# Altium schematic sheet 1_P1.schdoc
size 553 x 393 mm; Symbol: Sheet-Symbol_A4; Device: Sheet-Symbol_A4; @Page Name: P1; @Create Date: 2024-02-03; @Page Count: 1; @Page No: 1; @Project Name: 扫地机器人; @Schematic Name: Schematic1; @Update Date: 2025-04-30; Company: 嘉立创EDA; Page Size: A4; Version: V1.0
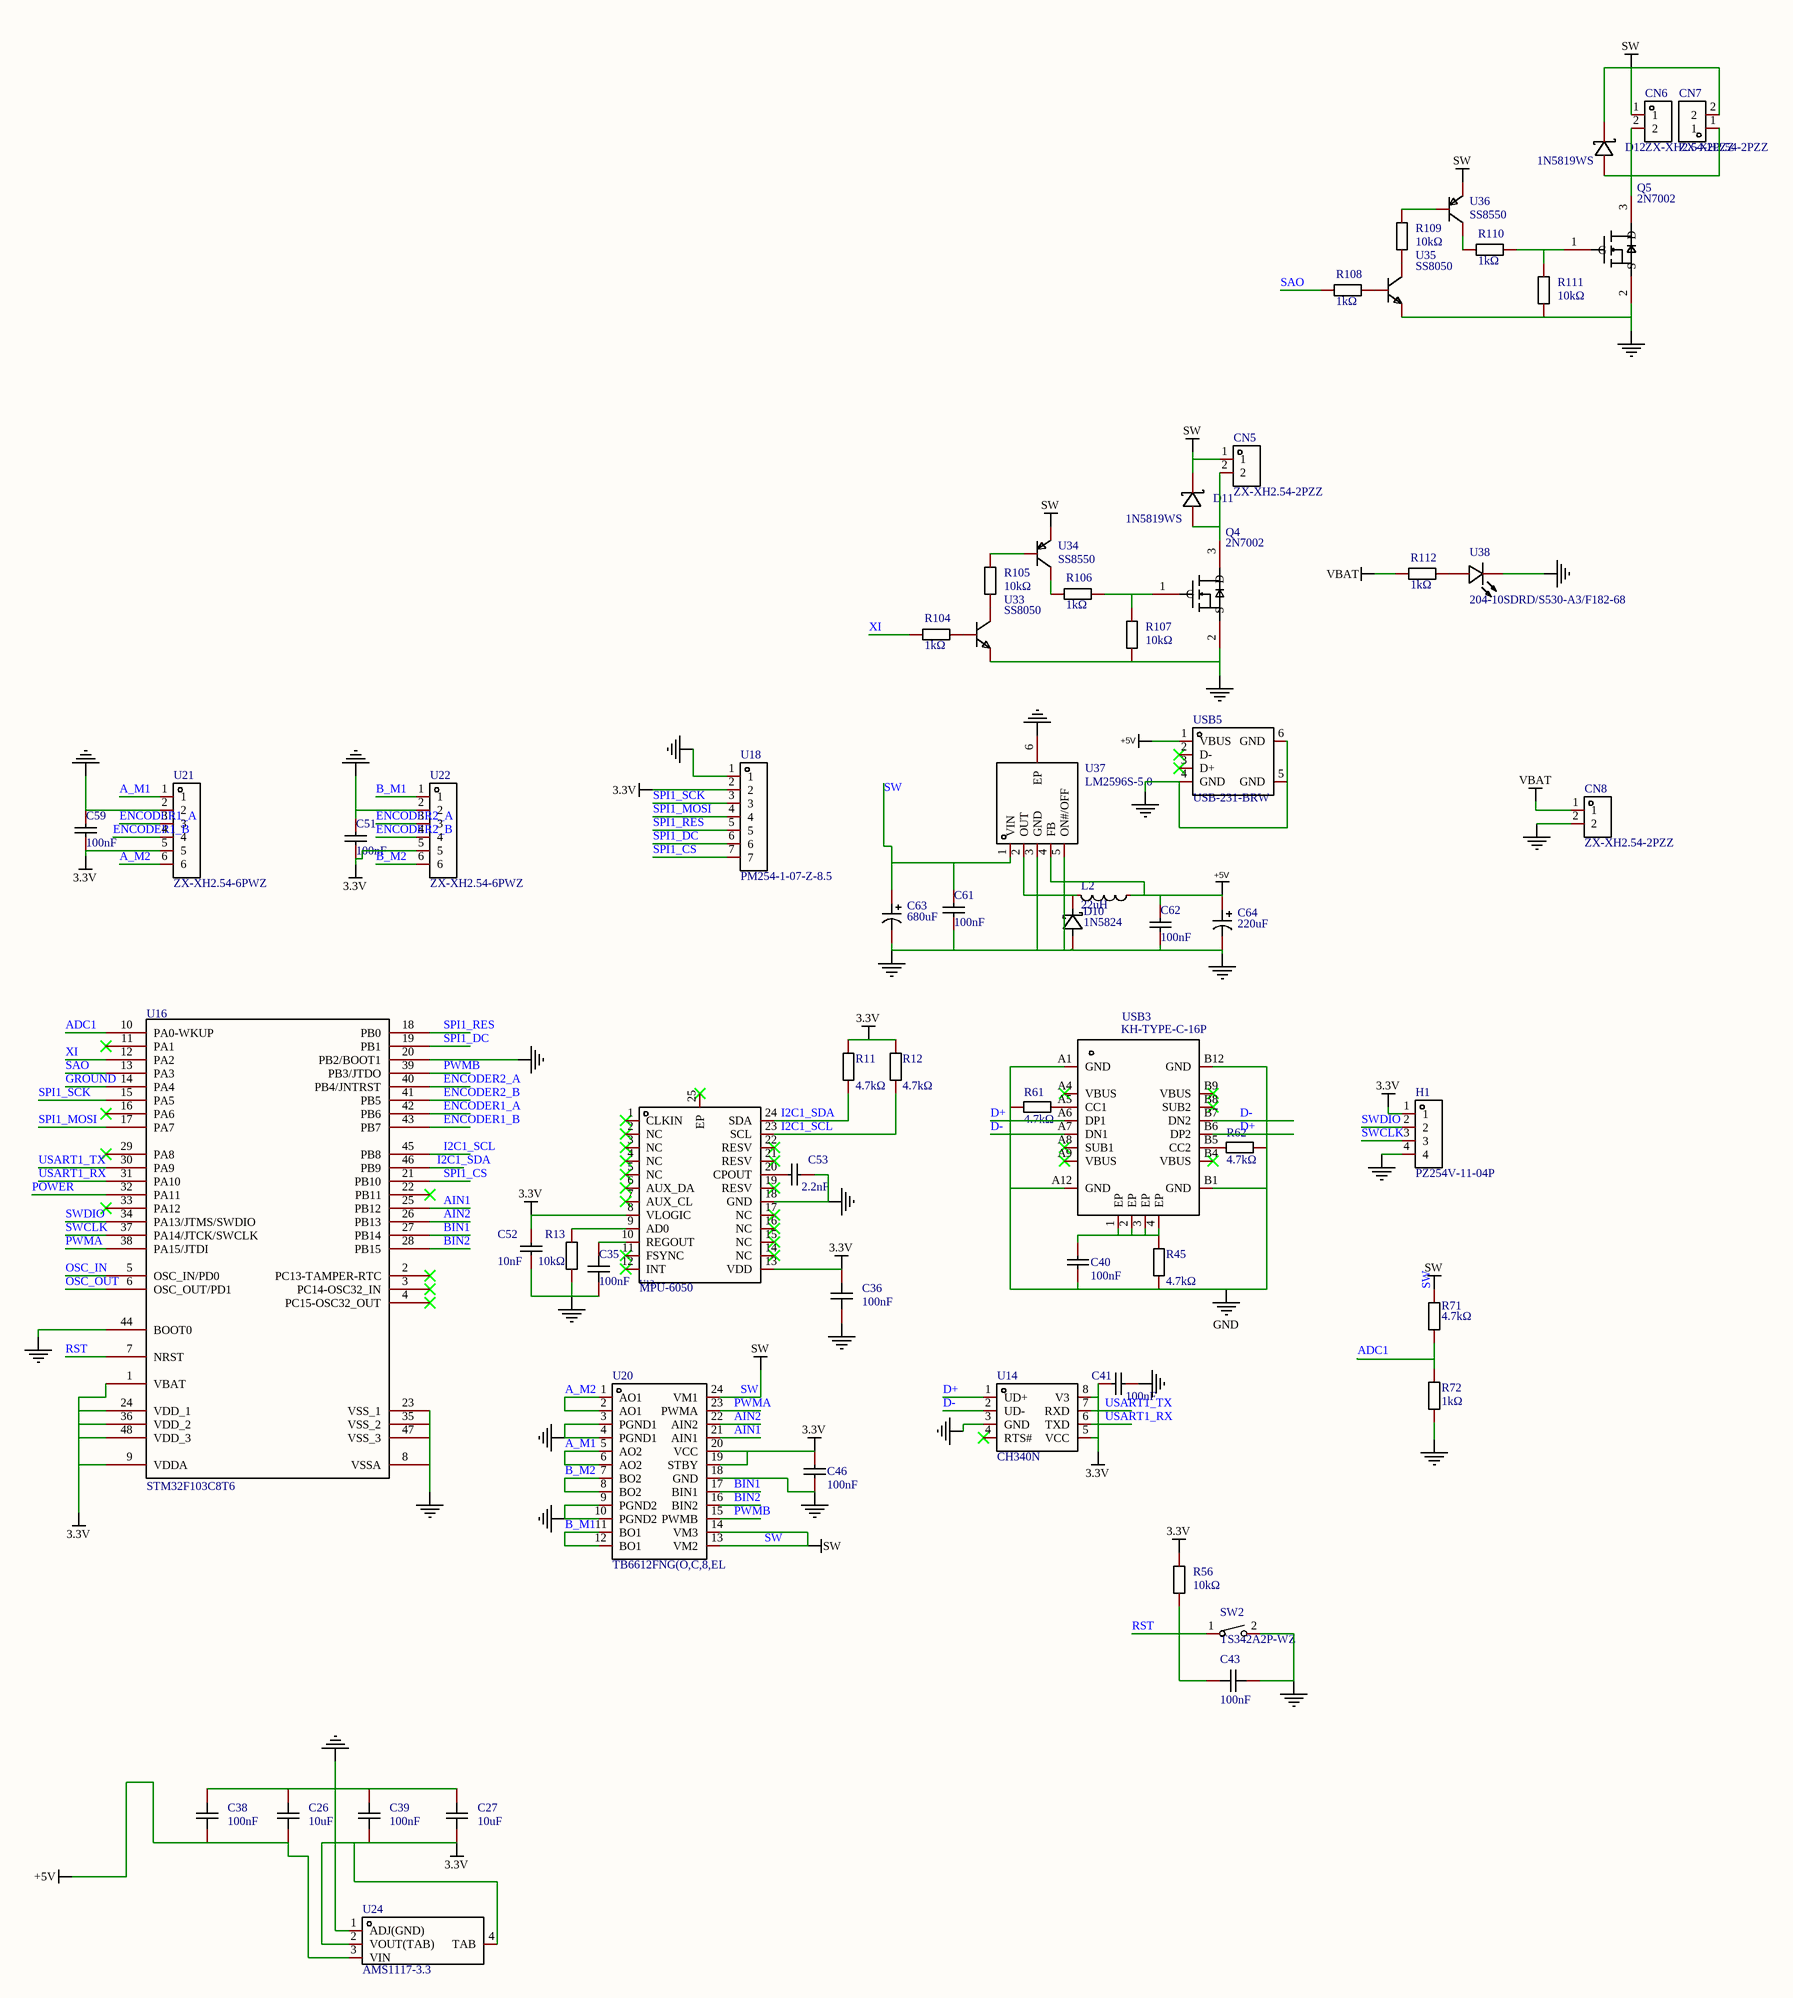
[diagram p0: 1_P1.schdoc]

## Parts
C26  10uF  [C0603]
C27  10uF  [C0603]
C35  100nF  [C0603]
C36  100nF  [C0603]
C38  100nF  [C0603]
C39  100nF  [C0603]
C40  100nF  [C0603]
C41  100nF  [C0603]
C43  100nF  [C0603]
C46  100nF  [C0603]
C51  100nF  [C0603]
C52  10nF  [C0603]
C53  2.2nF  [C0603]
C59  100nF  [C0603]
C61  100nF  [C0603]
C62  100nF  [C0603]
C63  680uF  [CAP-TH_BD10.0-P5.00-D0.6-FD]
C64  220uF  [CAP-TH_BD8.0-P3.50-D0.6-FD]
CN5  ZX-XH2.54-2PZZ  [CONN-TH_2P-P2.50_HX25003-2A]
CN6  ZX-XH2.54-2PZZ  [CONN-TH_2P-P2.50_HX25003-2A]
CN7  ZX-XH2.54-2PZZ  [CONN-TH_2P-P2.50_HX25003-2A]
CN8  ZX-XH2.54-2PZZ  [CONN-TH_2P-P2.50_HX25003-2A]
D10  1N5824  [DO-27_BD5.3-L8.4-P12.40-D1.3-RD]
D11  1N5819WS  [SOD-323_L1.8-W1.3-LS2.5-RD]
D12  1N5819WS  [SOD-323_L1.8-W1.3-LS2.5-RD]
H1  PZ254V-11-04P  [HDR-TH_4P-P2.54-V-M]
L2  22uH  [IND-SMD_L7.1-W6.6]
Q4  2N7002  [SOT-23-3_L2.9-W1.3-P1.90-LS2.4-BR]
Q5  2N7002  [SOT-23-3_L2.9-W1.3-P1.90-LS2.4-BR]
R11  4.7kΩ  [R0603]
R12  4.7kΩ  [R0603]
R13  10kΩ  [R0805]
R45  4.7kΩ  [R0603]
R56  10kΩ  [R0805]
R61  4.7kΩ  [R0603]
R62  4.7kΩ  [R0603]
R71  4.7kΩ  [R0603]
R72  1kΩ  [R0603]
R104  1kΩ  [R0603]
R105  10kΩ  [R0805]
R106  1kΩ  [R0603]
R107  10kΩ  [R0805]
R108  1kΩ  [R0603]
R109  10kΩ  [R0805]
R110  1kΩ  [R0603]
R111  10kΩ  [R0805]
R112  1kΩ  [R0603]
SW2  TS342A2P-WZ  [SW-SMD_L4.0-W2.9-LS5.0]
U12  MPU-6050  [QFN-24_L4.0-W4.0-P0.50-BL-EP2.7]
U14  CH340N  [SOP-8_L4.9-W3.9-P1.27-LS6.0-BL]
U16  STM32F103C8T6  [LQFP-48_L7.0-W7.0-P0.50-LS9.0-BL]
U18  PM254-1-07-Z-8.5  [HDR-TH_7P-P2.54-V-F]
U20  TB6612FNG(O,C,8,EL  [SSOP-24_L8.4-W5.8-P0.65-LS7.8-BL]
U21  ZX-XH2.54-6PWZ  [CONN-TH_6P-P2.50_ZX-XH2.54-6PWZ]
U22  ZX-XH2.54-6PWZ  [CONN-TH_6P-P2.50_ZX-XH2.54-6PWZ]
U24  AMS1117-3.3  [SOT-223_L6.7-W3.5-P2.30-BR]
U33  SS8050  [SOT-23-3_L2.9-W1.3-P1.90-LS2.4-BR]
U34  SS8550  [SOT-23-3_L2.9-W1.3-P1.90-LS2.4-BR]
U35  SS8050  [SOT-23-3_L2.9-W1.3-P1.90-LS2.4-BR]
U36  SS8550  [SOT-23-3_L2.9-W1.3-P1.90-LS2.4-BR]
U37  LM2596S-5.0  [TO-263-5_L10.2-W8.9-P1.70-BR]
U38  204-10SDRD/S530-A3/F182-68  [LED-TH_BD4.0-P2.50-RD]
USB3  KH-TYPE-C-16P  [USB-C-SMD_KH-TYPE-C-16P]
USB5  USB-231-BRW  [USB-A-TH_USB-231-ARY]

## Nets
3.3V: C27.1 C36.2 C39.1 C41.1 C46.1 C51.2 C52.1 C59.2 H1.1 R11.2 R12.2 R56.2 U12.8(VLOGIC) U12.13(VDD) U14.5(VCC) U14.8(V3) U16.1(VBAT) U16.9(VDDA) U16.24(VDD_1) U16.36(VDD_2) U16.48(VDD_3) U18.2 U20.19(STBY) U20.20(VCC) U21.5 U22.5 U24.2(VOUT(TAB)) U24.4(TAB)
+5V: C26.1 C38.1 C62.1 C64.1 L2.1 U24.3(VIN) U37.4(FB) USB5.1(VBUS)
GND: C40.2 R45.1 R61.1 R62.2 USB3.A1(GND) USB3.A12(GND) USB3.B1(GND) USB3.B12(GND)
NetC26_2: C26.2 C27.2 C35.1 C36.1 C38.2 C39.2 C41.2 C43.1 C46.2 C51.1 C52.2 C53.2 C59.1 C61.2 C62.2 C63.2 C64.2 CN8.2 D10.2(A) H1.4 Q4.2(S) Q5.2(S) R13.1 R72.1 R107.1 R111.1 SW2.2 U12.18(GND) U14.3(GND) U16.8(VSSA) U16.20(PB2/BOOT1) U16.23(VSS_1) U16.35(VSS_2) U16.44(BOOT0) U16.47(VSS_3) U18.1 U20.3(PGND1) U20.4(PGND1) U20.9(PGND2) U20.10(PGND2) U20.18(GND) U21.2 U22.2 U24.1(ADJ(GND)) U33.2(E) U35.2(E) U37.3(GND) U37.5(ON#/OFF) U37.6(EP) U38.1(C) USB5.4(GND) USB5.5(GND) USB5.6(GND)
SW: C61.1 C63.1 CN5.1 CN6.1 CN7.2 D11.1(K) D12.1(K) R71.2 U20.13(VM2) U20.14(VM3) U20.24(VM1) U34.2(E) U36.2(E) U37.1(VIN)
VBAT: CN8.1 R112.2
A_M1: U20.5(AO2) U20.6(AO2) U21.1
A_M2: U20.1(AO1) U20.2(AO1) U21.6
ADC1: R71.1 R72.2 U16.10(PA0-WKUP)
AIN1: U16.25(PB12) U20.21(AIN1)
AIN2: U16.26(PB13) U20.22(AIN2)
B_M1: U20.11(BO1) U20.12(BO1) U22.1
B_M2: U20.7(BO2) U20.8(BO2) U22.6
BIN1: U16.27(PB14) U20.17(BIN1)
BIN2: U16.28(PB15) U20.16(BIN2)
D+: U14.1(UD+) USB3.A6(DP1) USB3.B6(DP2)
D-: U14.2(UD-) USB3.A7(DN1) USB3.B7(DN2)
ENCODER1_A: U16.42(PB6) U21.3
ENCODER1_B: U16.43(PB7) U21.4
ENCODER2_A: U16.40(PB4/JNTRST) U22.3
ENCODER2_B: U16.41(PB5) U22.4
GROUND: U16.14(PA4)
I2C1_SCL: R12.1 U12.23(SCL) U16.45(PB8)
I2C1_SDA: R11.1 U12.24(SDA) U16.46(PB9)
OSC_IN: U16.5(OSC_IN/PD0)
OSC_OUT: U16.6(OSC_OUT/PD1)
POWER: U16.32(PA11)
PWMA: U16.38(PA15/JTDI) U20.23(PWMA)
PWMB: U16.39(PB3/JTDO) U20.15(PWMB)
RST: C43.2 R56.1 SW2.1 U16.7(NRST)
SAO: R108.2 U16.13(PA3)
SPI1_CS: U16.21(PB10) U18.7
SPI1_DC: U16.19(PB1) U18.6
SPI1_MOSI: U16.17(PA7) U18.4
SPI1_RES: U16.18(PB0) U18.5
SPI1_SCK: U16.15(PA5) U18.3
SWCLK: H1.3 U16.37(PA14/JTCK/SWCLK)
SWDIO: H1.2 U16.34(PA13/JTMS/SWDIO)
USART1_RX: U14.6(TXD) U16.31(PA10)
USART1_TX: U14.7(RXD) U16.30(PA9)
XI: R104.2 U16.12(PA2)
NetC35_2: C35.2 U12.10(REGOUT)
NetC40_1: C40.1 R45.2 USB3.1(EP) USB3.2(EP) USB3.3(EP) USB3.4(EP)
NetC53_1: C53.1 U12.20(CPOUT)
NetCN5_2: CN5.2 D11.2(A) Q4.3(D)
NetCN6_2: CN6.2 CN7.1 D12.2(A) Q5.3(D)
NetD10_1: D10.1(K) L2.2 U37.2(OUT)
NetQ4_1: Q4.1(G) R106.1 R107.2
NetQ5_1: Q5.1(G) R110.1 R111.2
NetR13_2: R13.2 U12.9(AD0)
NetR61_2: R61.2 USB3.A5(CC1)
NetR62_1: R62.1 USB3.B5(CC2)
NetR104_1: R104.1 U33.1(B)
NetR105_1: R105.1 U33.3(C)
NetR105_2: R105.2 U34.1(B)
NetR106_2: R106.2 U34.3(C)
NetR108_1: R108.1 U35.1(B)
NetR109_1: R109.1 U35.3(C)
NetR109_2: R109.2 U36.1(B)
NetR110_2: R110.2 U36.3(C)
NetR112_1: R112.1 U38.2(A)

Not connected (* = marked no-connect by the designer): U12 1(CLKIN)* 2(NC)* 3(NC)* 4(NC)* 5(NC)* 6(AUX_DA)* 7(AUX_CL)* 11(FSYNC)* 12(INT)* 14(NC)* 15(NC)* 16(NC)* 17(NC)* 19(RESV)* 21(RESV)* 22(RESV)* 25(EP)*; U14 4(RTS#)*; U16 2(PC13-TAMPER-RTC)* 3(PC14-OSC32_IN)* 4(PC15-OSC32_OUT)* 11(PA1)* 16(PA6)* 22(PB11)* 29(PA8)* 33(PA12)*; USB3 A4(VBUS)* A8(SUB1)* A9(VBUS)* B4(VBUS)* B8(SUB2)* B9(VBUS)*; USB5 2(D-)* 3(D+)*

## Notes on the sheet
- 1
- 2
- 3
- 4
- 5
- 6
- A
- B
- C
- D
- 原理图
- Schematic1
- 创建日期
- 更新日期
- 2024-02-03
- 2025-04-30
- 审阅
- 绘制
- 图页
- P1
- 物料编码
- 扫地机器人
- 版本
- 尺寸
- 页
- 共
- V1.0
- A4
- 嘉立创EDA

## Library data of the parts
C26 C27 = CL10A106KP8NNNC: 容值:10uF;精度:±10%;额定电压:10V;材质(温度系数):X5R;; Manufacturer: SAMSUNG(三星); Add into BOM: yes; Tolerance: ±10%; Voltage Rated: 10V; Temperature Coefficient: X5R; Name: 10uF; Symbol: CL10A106KP8NNNC; Device: CL10A106KP8NNNC; LCSC Part Name: 10uF ±10% 10V; Supplier Part: C19702; Manufacturer Part: CL10A106KP8NNNC; Supplier Footprint: 0603; JLCPCB Part Class: 基础库; Datasheet: https://atta.szlcsc.com/upload/public/pdf/source/20160218/1457707763339.pdf; Supplier: LCSC; Convert to PCB: yes; Value: 10uF
C35 C36 C38 C39 C43 = CC0603KRX7R9BB104: 容值:100nF;精度:±10%;额定电压:50V;材质(温度系数):X7R;; Manufacturer: YAGEO(国巨); Add into BOM: yes; Tolerance: ±10%; Voltage Rated: 50V; Temperature Coefficient: X7R; Name: 100nF; Symbol: CC0603KRX7R9BB104; Device: CC0603KRX7R9BB104; LCSC Part Name: 100nF ±10% 50V; Supplier Part: C14663; Manufacturer Part: CC0603KRX7R9BB104; Supplier Footprint: 0603; JLCPCB Part Class: Basic Part; Datasheet: https://atta.szlcsc.com/upload/public/pdf/source/20180910/C282072_33301C7F631E79921B82A8DAC6BCC5B3.pdf; Supplier: LCSC; Convert to PCB: yes; Value: 100nF
C40 C41 C46 C51 C59 C61 C62 = 0603B104K500NT: 容值:100nF;精度:±10%;额定电压:50V;材质(温度系数):X7R;; Manufacturer: FH(风华); Symbol: 0.1uf; Add into BOM: yes; Tolerance: ±10%; Voltage Rated: 50V; Temperature Coefficient: X7R; Origin Footprint: 0603-CAP; Name: 100nF; Device: 0603B104K500NT; LCSC Part Name: 100nF ±10% 50V; Supplier Part: C30926; Manufacturer Part: 0603B104K500NT; Supplier Footprint: 0603; JLCPCB Part Class: Extended Part; Datasheet: https://atta.szlcsc.com/upload/public/pdf/source/20200305/C486355_26A10D38EF8C2A5C37091D0039909270.pdf; Supplier: LCSC; Convert to PCB: yes; Value: 100nF; Published: 8-Jun-2000; LatestRevisionDate: 17-Jul-2002; LatestRevisionNote: Re-released for DXP Platform.; PackageReference: RAD-0.3; Publisher: Altium Limited
C52 = CC0603KRX7R9BB103: 容值:10nF;精度:±10%;额定电压:50V;材质(温度系数):X7R;; Manufacturer: YAGEO(国巨); Add into BOM: yes; Tolerance: ±10%; Voltage Rated: 50V; Temperature Coefficient: X7R; Name: 10nF; Symbol: CC0603KRX7R9BB103; Device: CC0603KRX7R9BB103; LCSC Part Name: 10nF ±10% 50V; Supplier Part: C100042; Manufacturer Part: CC0603KRX7R9BB103; Supplier Footprint: 0603; JLCPCB Part Class: 扩展库; Datasheet: https://atta.szlcsc.com/upload/public/pdf/source/20181008/C309510_22F155564471FAF6A489F7D68F34234E.pdf; Supplier: LCSC; Convert to PCB: yes; Value: 10nF
C53 = 0603B222K500NT: 容值:2.2nF;精度:±10%;额定电压:50V;材质(温度系数):X7R;; Manufacturer: FH(风华); Add into BOM: yes; Tolerance: ±10%; Voltage Rated: 50V; Temperature Coefficient: X7R; Name: 2.2nF; Symbol: 0603B222K500NT; Device: 0603B222K500NT; LCSC Part Name: 2.2nF ±10% 50V; Supplier Part: C1604; Manufacturer Part: 0603B222K500NT; Supplier Footprint: 0603; JLCPCB Part Class: 基础库; Datasheet: https://atta.szlcsc.com/upload/public/pdf/source/20200305/C486355_26A10D38EF8C2A5C37091D0039909270.pdf; Supplier: LCSC; Convert to PCB: yes; Value: 2.2nF
C63 = ERS1VM681G16OT: 容值:680uF;精度:±20%;额定电压:35V;纹波电流:-;等效串联电阻:-;; Manufacturer: AISHI(艾华集团); Add into BOM: yes; Tolerance: ±20%; Rated Voltage: 35V; Name: 680uF; Symbol: ERS1VM681G16OT; Device: ERS1VM681G16OT; LCSC Part Name: 680uF ±20% 35V; Supplier Part: C721283; Manufacturer Part: ERS1VM681G16OT; Supplier Footprint: 插件,D10xL16mm; JLCPCB Part Class: 扩展库; Datasheet: https://atta.szlcsc.com/upload/public/pdf/source/20191015/C438940_4B8E60A742BB0AE40DDEF87A5C89089D.pdf; Supplier: LCSC; Convert to PCB: yes; Value: 680uF; Ripple Current: -; Equivalent Series Resistance(ESR): -; Lead Spacing: -; φD: -; L: -; Lifetime @ Temp: -
C64 = 01EC3470: 容值:220uF;精度:±20%;额定电压:50V;纹波电流:350mA@120kHz;等效串联电阻:-;; Manufacturer: KNSCHA(科尼盛); Add into BOM: yes; Tolerance: ±20%; Rated Voltage: 50V; φD: 8mm; L: 12mm; Lifetime @ Temp: 2000hrs@105℃; Name: 220uF; Symbol: 01EC3470; Device: 01EC3470; LCSC Part Name: 220uF ±20% 50V; Supplier Part: C2836445; Manufacturer Part: 01EC3470; Supplier Footprint: 插件,D8xL12mm; JLCPCB Part Class: 扩展库; Datasheet: https://atta.szlcsc.com/upload/public/pdf/source/20210528/C2836445_4EB3DEC3C45633977FB5495C9B2E1697.pdf; Supplier: LCSC; Convert to PCB: yes; Value: 220uF; Ripple Current: 350mA@120kHz; Equivalent Series Resistance(ESR): -; Lead Spacing: 3.5mm; Operating Temperature: -40℃~+105℃
CN5-CN8 = ZX-XH2.54-2PZZ: 插针结构:1x2P;间距:2.54mm;安装方式:直插;参考系列:XH;总PIN数:2P;排数:1;每排PIN数:2;行距:-;额定电流:3A;触头材质:黄铜;触头镀层:锡;工作温度范围:-25℃~+85℃;; Manufacturer: Megastar(兆星); Add into BOM: yes; Pins Structure: 1x2P; Pitch: 2.54mm; Reference Series: XH; Number of PINs Per Row: 2; Current Rating (Max): 3A; Name: ZX-XH2.54-2PZZ; Symbol: ZX-XH2.54-2PZZ; Device: ZX-XH2.54-2PZZ; LCSC Part Name: ZX-XH2.54-2PZZ; Supplier Part: C7429632; Manufacturer Part: ZX-XH2.54-2PZZ; Supplier Footprint: 插件,P=2.54mm; JLCPCB Part Class: 扩展库; Datasheet: https://atta.szlcsc.com/upload/public/pdf/source/20230619/19BA6947230AA44A04D3EDD65E618FD0.pdf; Supplier: LCSC; Convert to PCB: yes; Mounting Style: 直插; Number of Pins: 2P; Number of Rows: 1; Row Spacing: -; Contact Material: 黄铜; Contact Plating: 锡; Operating Temperature Range: -25℃~+85℃
D10 = 1N5824_C7503125: 二极管配置:独立式;正向压降(Vf):550mV@5A;直流反向耐压(Vr):30V;平均整流电流(Io):5A;; Manufacturer: FUXINSEMI(富芯森美); Add into BOM: yes; Diode Configuration: 独立式; Reverse Voltage (Vr): 30V; Average Rectified Current (Io): 5A; Reverse Leakage Current (Ir): 500uA@30V; Peak forward surge current: 150A; Name: 1N5824; Symbol: 1N5824_C7503125; Device: 1N5824_C7503125; LCSC Part Name: 电压:30V 电流:5A; Supplier Part: C7503125; Manufacturer Part: 1N5824; Supplier Footprint: DO-201AD; JLCPCB Part Class: 扩展库; Datasheet: https://atta.szlcsc.com/upload/public/pdf/source/20230904/20F3394C6D1B7A17743713246CA97DB3.pdf; Supplier: LCSC; Convert to PCB: yes; Forward Voltage (Vf@If): 550mV@5A
D11 D12 = 1N5819WS_C191023: 正向压降(Vf):600mV@1A;直流反向耐压(Vr):40V;整流电流:1A;; Manufacturer: Hottech(合科泰); Add into BOM: yes; Reverse Voltage (Vr): 40V; Rectified Current: 1A; Name: 1N5819WS; Symbol: 1N5819WS; Device: 1N5819WS_C191023; LCSC Part Name: 电压:40V 电流:1A; Supplier Part: C191023; Manufacturer Part: 1N5819WS; Supplier Footprint: SOD-323; JLCPCB Part Class: Basic Part; Datasheet: https://atta.szlcsc.com/upload/public/pdf/source/20220428/3CB86FD8D28D653594B4E35F9D5AEFD9.pdf; Supplier: LCSC; Convert to PCB: yes; Forward Voltage (Vf@If): 600mV@1A
H1 = PZ254V-11-04P: 插针结构:1x4P;间距:2.54mm;行距:-;圆针/方针:方针;安装类型:直插;排数:单排;总PIN位数:4P;额定电流:3A;额定电压:250V;配合针长度:6mm;塑高:2.5mm;端接针长度:3mm;触头材质:-;工作温度范围:-40℃~+105℃;颜色:黑色;; Manufacturer: XFCN(兴飞); Symbol: PZ254V-11-04P_C2691448; Add into BOM: yes; Pin Structure: 1x4P; Pitch: 2.54mm; Circluar Pins/Square Pins: 方针; Current Rating (Max): 3A; Voltage Rating (Max): 250V; Name: PZ254V-11-04P; Device: PZ254V-11-04P; LCSC Part Name: 间距:2.54mm 1x4P 直插 方针; Supplier Part: C2691448; Manufacturer Part: PZ254V-11-04P; Supplier Footprint: 插件,P=2.54mm; JLCPCB Part Class: 扩展库; Datasheet: https://atta.szlcsc.com/upload/public/pdf/source/20200309/C492403_F9F19131791D08044AD4F84F8E751A34.pdf; Supplier: LCSC; Convert to PCB: yes; Row Spacing: -; Mounting Type: 直插; Number of Rows: 单排; Number of Pins: 4P; Length of Mating Pin: 6mm; Insulation Height: 2.5mm; Length of End Connection Pin: 3mm; Contact Material: -; Operating Temperature Range: -40℃~+105℃; Color: 黑色
L2 = SLO0630H220MTT: 电感值:22uH;精度:±20%;额定电流:-;; Manufacturer: Sunltech(韩国顺磁); Add into BOM: yes; Tolerance: ±20%; Name: 22uH; Symbol: SLO0630H220MTT; Device: SLO0630H220MTT; LCSC Part Name: 22uH ±20%; Supplier Part: C207843; Manufacturer Part: SLO0630H220MTT; Supplier Footprint: SMD; JLCPCB Part Class: 扩展库; Datasheet: https://atta.szlcsc.com/upload/public/pdf/source/20190925/C207844_D5F1113EB7E791F3C24FBC0C5D2BA774.pdf; Supplier: LCSC; Convert to PCB: yes; Value: 22uH; Rated Current: -; DC Resistance (DCR): -
Q4 Q5 = 2N7002_C916396: 类型:1个N沟道;漏源电压(Vdss):60V;连续漏极电流(Id):115mA;导通电阻(RDS(on)@Vgs,Id):1.2Ω@10V,500mA;功率(Pd):200mW;阈值电压(Vgs(th)@Id):2.1V@250uA;; Manufacturer: JSMSEMI(杰盛微); Add into BOM: yes; Type: 1个N沟道; Drain Source Voltage (Vdss): 60V; Continuous Drain Current (Id): 115mA; Power Dissipation (Pd): 200mW; Input Capacitance (Ciss@Vds): 20pF@25V; Reverse Transfer Capacitance (Crss@Vds): 4pF@25V; Name: 2N7002; Symbol: 2n7002_c916396; Device: 2N7002_C916396; LCSC Part Name: 1个N沟道 耐压:60V 电流:115mA; Supplier Part: C916396; Manufacturer Part: 2N7002; Supplier Footprint: SOT-23; JLCPCB Part Class: 扩展库; Datasheet: https://atta.szlcsc.com/upload/public/pdf/source/20230714/89F30C6A193AD72E5F1F14B53E304F4A.pdf; Supplier: LCSC; Convert to PCB: yes; Drain Source On Resistance (RDS(on)@Vgs,Id): 1.2Ω@10V,500mA; Gate Threshold Voltage (Vgs(th)@Id): 2.1V@250uA; Total Gate Charge (Qg@Vgs): -; Operating Temperature: -
R11 R12 R45 R61 R62 R71 = 0603WAF4701T5E: 电阻类型:厚膜电阻;阻值:4.7kΩ;精度:±1%;功率:100mW;最大工作电压:75V;温度系数:±100ppm/℃;; Manufacturer: UNI-ROYAL(厚声); Add into BOM: yes; Tolerance: ±1%; Power(Watts): 100mW; Overload Voltage (Max): 75V; Name: 4.7kΩ; Symbol: 0603WAF4701T5E; Device: 0603WAF4701T5E; LCSC Part Name: 4.7kΩ ±1% 100mW 厚膜电阻; Supplier Part: C23162; Manufacturer Part: 0603WAF4701T5E; Supplier Footprint: 0603; JLCPCB Part Class: 基础库; Datasheet: https://atta.szlcsc.com/upload/public/pdf/source/20200306/C422600_1E6D84923E4A46A82E41ADD87F860B5C.pdf; Supplier: LCSC; Convert to PCB: yes; Type: 厚膜电阻; Value: 4.7kΩ; Temperature Coefficient: ±100ppm/℃; Operating Temperature Range: -55℃~+155℃
R13 R56 R105 R107 R109 R111 = RT0805BRD0710KL: 电阻类型:薄膜电阻;阻值:10kΩ;精度:±0.1%;功率:125mW;; Manufacturer: YAGEO(国巨); Add into BOM: yes; Tolerance: ±0.1%; Power(Watts): 125mW; Temperature Coefficient: ±25ppm/℃; Overload Voltage (Max): 150V; Name: 10kΩ; Symbol: RT0805BRD0710KL; Device: RT0805BRD0710KL; LCSC Part Name: 10kΩ ±0.1% 125mW; Supplier Part: C110775; Manufacturer Part: RT0805BRD0710KL; Supplier Footprint: 0805; JLCPCB Part Class: Extended Part; Datasheet: https://atta.szlcsc.com/upload/public/pdf/source/20170712/C110775_1499832265525814218.pdf; Supplier: LCSC; Convert to PCB: yes; Type: 薄膜电阻; Value: 10kΩ; Operating Temperature Range: -55℃~+155℃
R72 R104 R106 R108 R110 R112 = 0603WAF1001T5E: 电阻类型:厚膜电阻;阻值:1kΩ;精度:±1%;功率:100mW;最大工作电压:75V;温度系数:±100ppm/℃;; Manufacturer: UNI-ROYAL(厚声); Add into BOM: yes; Tolerance: ±1%; Power(Watts): 100mW; Overload Voltage (Max): 75V; Name: 1kΩ; Symbol: 0603WAF1001T5E; Device: 0603WAF1001T5E; LCSC Part Name: 1kΩ ±1% 100mW 厚膜电阻; Supplier Part: C21190; Manufacturer Part: 0603WAF1001T5E; Supplier Footprint: 0603; JLCPCB Part Class: 基础库; Datasheet: https://atta.szlcsc.com/upload/public/pdf/source/20200306/C422600_1E6D84923E4A46A82E41ADD87F860B5C.pdf; Supplier: LCSC; Convert to PCB: yes; Type: 厚膜电阻; Value: 1kΩ; Temperature Coefficient: ±100ppm/℃; Operating Temperature Range: -55℃~+155℃
SW2 = TS342A2P-WZ: 电路结构:单刀单掷;带支架:否;触点电流:50mA;额定电压(DC):12V;安装方式:立贴;绝缘电阻:100MΩ;机械寿命:3万次;; Manufacturer: SHOU HAN(首韩); Add into BOM: yes; Circuit: 单刀单掷; Actuator Style: 圆形按钮; Switch Length: 3.95mm; Switch Width: 2.9mm; Switch Height: 2mm; Strike Gundam: 否; Contact Current: 50mA; Voltage Rating (DC): 12V; Insulation Resistance: 100MΩ; Actuator/Cap Color: 黑色; Pin Style: SMD接片; Mechanical Life: 3万次; Name: TS342A2P-WZ; Symbol: TS342A2P-WZ; Device: TS342A2P-WZ; LCSC Part Name: 3.95*2.9*2mm 立贴 轻触开关; Supplier Part: C557591; Manufacturer Part: TS342A2P-WZ; Supplier Footprint: SMD; JLCPCB Part Class: 扩展库; Datasheet: https://atta.szlcsc.com/upload/public/pdf/source/20200519/C557591_B3A5A21584733303F06306F18577DA8B.pdf; Supplier: LCSC; Convert to PCB: yes; Mounting Style: 立贴; Operating Temperature: -25℃~+70℃
U12 = MPU-6050: 三轴加速度计和三轴陀螺仪，工作电压：2.375V~3.46V; Manufacturer: TDK InvenSense(应美盛); Symbol: MPU-6050_C24112; Add into BOM: yes; Name: MPU-6050; Device: MPU-6050; LCSC Part Name: MPU-6050; Supplier Part: C24112; Manufacturer Part: MPU-6050; Supplier Footprint: QFN-24(4x4); JLCPCB Part Class: 扩展库; Datasheet: https://atta.szlcsc.com/upload/public/pdf/source/20140425/1457707046159.pdf; Supplier: LCSC; Convert to PCB: yes
U14 = CH340N: Manufacturer: WCH(南京沁恒); Symbol: CH340N_C2977777; Add into BOM: yes; Name: CH340N; Device: CH340N; LCSC Part Name: USB转串口芯片 CH340; Supplier Part: C2977777; Manufacturer Part: CH340N; Supplier Footprint: SOP-8; JLCPCB Part Class: 扩展库; Datasheet: https://atta.szlcsc.com/upload/public/pdf/source/20230530/6E401E9554E9F5311886CC8B3F89B62E.pdf; Supplier: LCSC; Convert to PCB: yes
U16 = STM32F103C8T6: CPU内核:CM3;程序存储容量:64KB;RAM总容量:20KB;GPIO端口数量:37;工作电压范围:2V~3.6V;CPU最大主频:72MHz;程序存储器类型:FLASH;; Manufacturer: ST(意法半导体); Add into BOM: yes; CPU Core: CM3; Program Storage Size: 64KB; RAM Size: 20KB; GPIO Ports Number: 37; CPU Maximum Speed: 72MHz; Program Memory Type: FLASH; ADC (Bit): 12bit; Universal Serial Bus: 有; Peripheral/Function: 看门狗；DMA；看门狗；片载温度传感器; Origin Footprint: LQFP48; Name: STM32F103C8T6; Symbol: stm32f103c8t6; Device: STM32F103C8T6; LCSC Part Name: STM32F103C8T6 MSL=3; Supplier Part: C8734; Manufacturer Part: STM32F103C8T6; Supplier Footprint: LQFP-48(7x7); JLCPCB Part Class: Extended Part; Datasheet: https://atta.szlcsc.com/upload/public/pdf/source/20220812/8363ACEC51AD55ECEB84799464F7CB85.pdf; Supplier: LCSC; Convert to PCB: yes; Operating Voltage Range: 2V~3.6V; Operating Temperature Range: -40℃~+85℃; DAC (Bit): -; PWM (Bit): -; Internal Comparator: -; communication protocol: -; Watchdog: 有; Real-Time Clock: -; Infrared Data Association: 有; Low-Voltage Detect: 有; CCP Capture/Compare: -; Secure Digital Input and Output: -; Direct Memory Access: 有; Internal Oscillator: 有; Published: 30-May-2008; DatasheetVersion: rev6, Mar-2008; PackageVersion: Mar-2008; PackageReference: LQFP48; Publisher: Altium Limited; PackageDescription: 48-Pin Low-Profile Quad Flat Pack, 7 x 7 mm Body, 0.5 mm Pitch (LQFP48); ComponentLink1Description: Manufacturer Link; ComponentLink1URL: www.st.com/stm32; ComponentLink2Description: Datasheet; ComponentLink2URL: http://www.st.com/stonline/products/literature/ds/13587.pdf
U18 = PM254-1-07-Z-8.5: 插孔结构:1x7P;间距:2.54mm;行距:-;圆孔/方孔:方孔;安装类型:直插;排数:单排;总孔位数:7P;额定电流:3A;额定电压:-;插孔方向:顶部;塑高:8.5mm;触头材质:铜合金;工作温度范围:-40℃~+105℃;焊接温度(最大值):260℃@5S;; Manufacturer: HCTL(华灿天禄); Add into BOM: yes; Holes Structure: 1x7P; Pitch: 2.54mm; Circular Hole / Square Hole: 方孔; Number of Holes: 7P; Current Rating (Max): 3A; Holes Direction: 顶部; Name: PM254-1-07-Z-8.5; Symbol: PM254-1-07-Z-8.5; Device: PM254-1-07-Z-8.5; LCSC Part Name: 1x7P 间距:2.54mm 直插; Supplier Part: C2897370; Manufacturer Part: PM254-1-07-Z-8.5; Supplier Footprint: 插件,P=2.54mm; JLCPCB Part Class: 扩展库; Datasheet: https://atta.szlcsc.com/upload/public/pdf/source/20230609/534BE42964C679BDE98E061007C4ABD6.pdf; Supplier: LCSC; Convert to PCB: yes; Row Spacing: -; Mounting Type: 直插; Number of Rows: 单排; Voltage Rating (Max): -; Insulation Height: 8.5mm; Contact Material: 铜合金; Operating Temperature Range: -40℃~+105℃; Soldering Temperature(Max): 260℃@5S
U20 = TB6612FNG(O,C,8,EL: 双直流电机驱动器集成电路; Manufacturer: TOSHIBA(东芝); Add into BOM: yes; Name: TB6612FNG(O,C,8,EL; Symbol: TB6612FNG(O,C,8,EL; Device: TB6612FNG(O,C,8,EL; LCSC Part Name: TB6612FNG(O,C,8,EL; Supplier Part: C88224; Manufacturer Part: TB6612FNG(O,C,8,EL; Supplier Footprint: SSOP-24-208mil; JLCPCB Part Class: 扩展库; Datasheet: https://atta.szlcsc.com/upload/public/pdf/source/20171128/C141517_15118625624231147036.pdf; Supplier: LCSC; Convert to PCB: yes
U21 U22 = ZX-XH2.54-6PWZ: 插针结构:1x6P;间距:2.54mm;安装方式:弯插;参考系列:XH;总PIN数:6P;排数:1;每排PIN数:6;行距:-;额定电流:3A;触头材质:黄铜;触头镀层:锡;工作温度范围:-25℃~+85℃;; Manufacturer: Megastar(兆星); Add into BOM: yes; Pins Structure: 1x6P; Pitch: 2.54mm; Reference Series: XH; Number of PINs Per Row: 6; Current Rating (Max): 3A; Name: ZX-XH2.54-6PWZ; Symbol: ZX-XH2.54-6PWZ; Device: ZX-XH2.54-6PWZ; LCSC Part Name: ZX-XH2.54-6PWZ; Supplier Part: C7429645; Manufacturer Part: ZX-XH2.54-6PWZ; Supplier Footprint: 弯插,P=2.54mm; JLCPCB Part Class: 扩展库; Datasheet: https://atta.szlcsc.com/upload/public/pdf/source/20230619/9057EB94260093B1525D11E652DE2D7A.pdf; Supplier: LCSC; Convert to PCB: yes; Mounting Style: 弯插; Number of Pins: 6P; Number of Rows: 1; Row Spacing: -; Contact Material: 黄铜; Contact Plating: 锡; Operating Temperature Range: -25℃~+85℃
U24 = AMS1117-5.0_C347223: 输出类型:固定;最大输入电压:12V;输出电压:5V;最大输出电流:1A;电源纹波抑制比(PSRR):60dB@(120Hz);输出极性:正极;; Manufacturer: UMW(友台半导体); Add into BOM: yes; Output Type: 固定; Maximum Input Voltage: 12V; Output Voltage: 5V; MAX Output Current: 1A; Dropout Voltage: 1.3V@(1A); Output Polarity: 正极; Number of Outputs: 1; Name: AMS1117-3.3; Symbol: AMS1117-5.0_C347223; Device: AMS1117-5.0_C347223; LCSC Part Name: 输出:5V 电流:1A 耐压:12V; Supplier Part: C347223; Manufacturer Part: AMS1117-3.3; Supplier Footprint: SOT-223; JLCPCB Part Class: 扩展库; Datasheet: https://atta.szlcsc.com/upload/public/pdf/source/20231109/155D79A26D9DB04352555A58D5969DC8.pdf; Supplier: LCSC; Convert to PCB: yes; Power Supply Rejection Ratio (PSRR): 60dB@(120Hz); standby current: -; Noise: -; Feature: -; Operating Temperature: -
U33 U35 = SS8050_C7420370: 晶体管类型:NPN;集电极电流(Ic):1.5A;集射极击穿电压(Vceo):25V;功率(Pd):300mW;直流电流增益(hFE@Ic,Vce):120@100mA,1.0V;; Manufacturer: 宏迦橙; Add into BOM: yes; Transistor Type: NPN; Collector Current (Ic): 1.5A; Collector-Emitter Breakdown Voltage (Vceo): 25V; Power Dissipation (Pd): 300mW; Transition Frequency (fT): 100MHz; Collector Cut-Off Current (Icbo): 100nA; Collector-Emitter Saturation Voltage (VCE(sat)@Ic,Ib): 500mV@800mA,80mA; Name: SS8050; Symbol: SS8050_C7420370; Device: SS8050_C7420370; LCSC Part Name: 耐压:25V 电流:1.5A NPN H档 200-350; Supplier Part: C7420370; Manufacturer Part: SS8050; Supplier Footprint: SOT-23; JLCPCB Part Class: 扩展库; Datasheet: https://atta.szlcsc.com/upload/public/pdf/source/20231222/9C4050A7669EB24B3ACD0418218817FD.pdf; Supplier: LCSC; Convert to PCB: yes; DC Current Gain (hFE@Ic,Vce): 120@100mA,1.0V; Operating Temperature: -55℃~+150℃
U34 U36 = SS8550_C7420371: 晶体管类型:PNP;集电极电流(Ic):1.5A;集射极击穿电压(Vceo):25V;功率(Pd):300mW;直流电流增益(hFE@Ic,Vce):120@100mA,1.0V;; Manufacturer: 宏迦橙; Add into BOM: yes; Transistor Type: PNP; Collector Current (Ic): 1.5A; Collector-Emitter Breakdown Voltage (Vceo): 25V; Power Dissipation (Pd): 300mW; Transition Frequency (fT): 100MHz; Collector Cut-Off Current (Icbo): 100nA; Collector-Emitter Saturation Voltage (VCE(sat)@Ic,Ib): 500mV@800mA,80mA; Name: SS8550; Symbol: SS8550_C7420371; Device: SS8550_C7420371; LCSC Part Name: 耐压:25V 电流:1.5A PNP H档 200-350; Supplier Part: C7420371; Manufacturer Part: SS8550; Supplier Footprint: SOT-23; JLCPCB Part Class: 扩展库; Datasheet: https://atta.szlcsc.com/upload/public/pdf/source/20231222/5BDA6DBF3A79C59009F81F0EEE6F8969.pdf; Supplier: LCSC; Convert to PCB: yes; DC Current Gain (hFE@Ic,Vce): 120@100mA,1.0V; Operating Temperature: -55℃~+150℃
U37 = LM2596S-5.0_C347421: 功能类型:降压型;输出类型:固定;输入电压:40V;输出电压:5V;输出电流:3A;; Manufacturer: UMW(友台半导体); Add into BOM: yes; Function: 降压型; Output Type: 固定; Input Voltage: 40V; Output Voltage: 5V; Output Current: 3A; Switching Frequency: 150kHz; Synchronous Rectification: 否; Number of Outputs: 1; Topology: 降压式; Switch tube (built-in/external): 内置; Name: LM2596S-5.0; Symbol: LM2596S-5.0; Device: LM2596S-5.0_C347421; LCSC Part Name: LM2596S-5.0; Supplier Part: C347421; Manufacturer Part: LM2596S-5.0; Supplier Footprint: TO-263-5; JLCPCB Part Class: 扩展库; Datasheet: https://atta.szlcsc.com/upload/public/pdf/source/20230506/0930E65C3A8B7B120C8A4D8E5A8AC327.pdf; Supplier: LCSC; Convert to PCB: yes; Operating Temperature: -40℃~+125℃@(TA)
U38 = 204-10SDRD/S530-A3/F182-68: -; Manufacturer: EVERLIGHT(亿光); Add into BOM: yes; Name: 204-10SDRD/S530-A3/F182-68; Symbol: 204-10SDRD/S530-A3/F182-68; Device: 204-10SDRD/S530-A3/F182-68; LCSC Part Name: 204-10SDRD/S530-A3/F182-68; Supplier Part: C473831; Manufacturer Part: 204-10SDRD/S530-A3/F182-68; Supplier Footprint: 插件; JLCPCB Part Class: 扩展库; Supplier: LCSC; Convert to PCB: yes
USB3 = KH-TYPE-C-16P: 连接器类型:Type-C;标准:-;公母:母;端口数量:1;触点数量:16P;安装方式:卧贴;额定电流 - 电源:3A;工作温度范围:-40℃~+85℃;; Manufacturer: kinghelm(金航标); Add into BOM: yes; Connector Type: Type-C; Gender: 母; Number of Ports: 1; Number of Contacts: 16P; Current Rating - Power (Max): 3A; Name: KH-TYPE-C-16P; Symbol: kh-type-c-16p; Device: KH-TYPE-C-16P; LCSC Part Name: Type-C 母 卧贴; Supplier Part: C709357; Manufacturer Part: KH-TYPE-C-16P; Supplier Footprint: SMD; JLCPCB Part Class: Extended Part; Datasheet: https://atta.szlcsc.com/upload/public/pdf/source/20200911/C709357_AA8DCEB38BB20E3035A7ED7AE7667837.pdf; Supplier: LCSC; Convert to PCB: yes; Standard: -; Mounting Style: 卧贴; Operating Temperature Range: -40℃~+85℃; Origin Footprint: USB-C-SMD_KH-TYPE-C-16P
USB5 = USB-231-BRW: 连接器类型:Type-A;标准:USB 2.0;公母:母;端口数量:1;触点数量:4P;安装方式:弯插;额定电流 - 电源:1.5A;触头材质:-;触头镀层:-;工作温度范围:-20℃~+70℃;焊接温度(最大值):260℃;; Manufacturer: XUNPU(讯普); Add into BOM: yes; Connector Type: Type-A; Gender: 母; Number of Ports: 1; Number of Contacts: 4P; Current Rating - Power (Max): 1.5A; Soldering Temperature(Max): 260℃; Name: USB-231-BRW; Symbol: USB-231-BRW; Device: USB-231-BRW; LCSC Part Name: Type-A 母 弯插; Supplier Part: C720526; Manufacturer Part: USB-231-BRW; Supplier Footprint: 插件; JLCPCB Part Class: 扩展库; Datasheet: https://atta.szlcsc.com/upload/public/pdf/source/20200810/C720526_4837E23757308E8DFF7007387B1B5646.pdf; Supplier: LCSC; Convert to PCB: yes; Standard: USB 2.0; Mounting Style: 弯插; Contact Material: -; Contact Plating: -; Operating Temperature Range: -20℃~+70℃